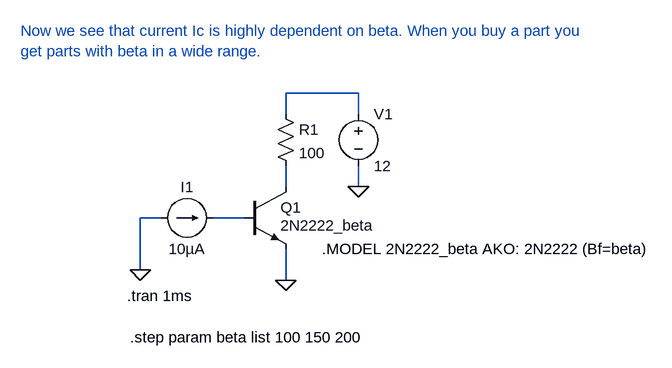
[diagram p0: schematic BaseBias03.asc]
BaseBias03.asc, the LTspice schematic file:
Version 4
SHEET 1 880 680
WIRE 336 -32 224 -32
WIRE 224 0 224 -32
WIRE 336 0 336 -32
WIRE 224 112 224 80
WIRE 336 112 336 80
WIRE 32 160 0 160
WIRE 160 160 112 160
WIRE 0 240 0 160
WIRE 224 256 224 208
FLAG 0 240 0
FLAG 224 256 0
FLAG 336 112 0
SYMBOL npn 160 112 R0
WINDOW 3 56 60 Left 2
SYMATTR InstName Q1
SYMATTR Value 2N2222_beta
SYMBOL current 32 160 R270
WINDOW 0 32 40 VTop 2
WINDOW 3 -32 40 VBottom 2
WINDOW 123 0 0 Left 0
WINDOW 39 0 0 Left 0
SYMATTR InstName I1
SYMATTR Value 10µA
SYMBOL res 208 -16 R0
SYMATTR InstName R1
SYMATTR Value 100
SYMBOL voltage 336 -16 R0
WINDOW 123 0 0 Left 0
WINDOW 39 0 0 Left 0
SYMATTR InstName V1
SYMATTR Value 12
TEXT -20 280 Left 2 !.tran 1ms
TEXT 280 208 Left 2 !.MODEL 2N2222_beta AKO: 2N2222 (Bf=beta)
TEXT -16 344 Left 2 !.step param beta list 100 150 200
TEXT -184 -128 Left 2 ;Now we see that current Ic is highly dependent on beta. When you buy a part you\nget parts with beta in a wide range.

The netlist it stands for:
* BaseBias03.asc
Q1 N002 N003 0 0 2N2222_beta
I1 0 N003 10µA
R1 N001 N002 100
V1 N001 0 12
.model NPN NPN
.model PNP PNP
.lib standard.bjt
.tran 1ms
.MODEL 2N2222_beta AKO: 2N2222 (Bf=beta)
.step param beta list 100 150 200
* Now we see that current Ic is highly dependent on beta. When you buy a part you
* get parts with beta in a wide range.
.backanno
.end